# EAGLE design MBusUART-DIN (EAGLE 9.2.2)
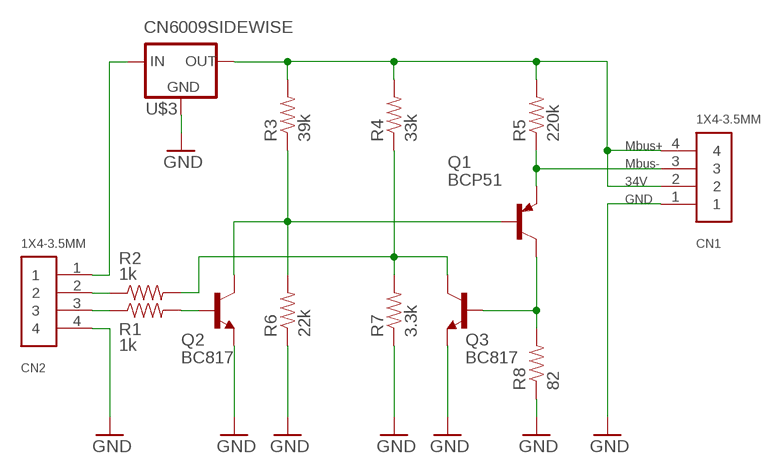
[diagram p0: schematic, sheet 1]

## Parts
CN1  1X4-3.5MM  [1X04-3.5MM]
CN2  1X4-3.5MM  [1X04-3.5MM]
Q1  BCP51  BCP51SOT223  [SOT223]
Q2  BC817  BC817-16SMD  [SOT23-BEC]
Q3  BC817  BC817-16SMD  [SOT23-BEC]
R1  1k  RESISTOR0805-RES  [0805]
R2  1k  RESISTOR0805-RES  [0805]
R3  39k  RESISTOR0805-RES  [0805]
R4  33k  RESISTOR0805-RES  [0805]
R5  220k  RESISTOR1206  [1206]
R6  22k  RESISTOR0805-RES  [0805]
R7  3.3k  RESISTOR0805-RES  [0805]
R8  82  RESISTOR1206  [1206]
U$3  CN6009SIDEWISE  [CN6009-SIDEWISE]

## Nets
34V: CN1.2 CN1.4 R3.2 R4.2 R5.2 U$3.P$4(OUT) U$3.P$41(OUT)
B: Q1.1(B) Q2.C R3.1 R6.2
GND: CN1.1 CN2.4 Q2.E Q3.E R6.1 R7.1 R8.1 U$3.P$1(GND) U$3.P$2(GND) U$3.P$11(GND) U$3.P$21(GND)
MBUS-: CN1.3 Q1.3(E) R5.1
N$1: Q3.C R2.2 R4.1 R7.2
N$2: CN2.1 U$3.P$3(IN) U$3.P$31(IN)
N$3: Q1.2(C) Q1.4(C) Q3.B R8.2
N$7: CN2.2 R2.1
N$8: CN2.3 R1.1
N$9: Q2.B R1.2

## Notes on the sheet
- Mbus+
- Mbus-

## Library data of the parts
CN1 CN2 = adafruit:1X4: 4-pin connector
Q1 = TaaraLabs:BCP51
Q2 Q3 = transistor-npn:BC817*: NPN Transistor
R1-R8 = SparkFun:RESISTOR: Resistor Basic schematic elements and footprints for 0603, 1206, and PTH resistors.
U$3 = TaaraLabs:CN6009

## Board
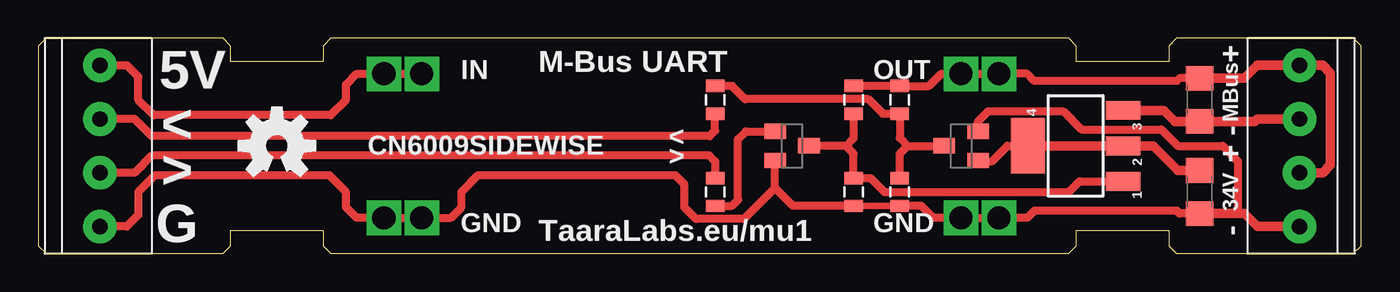
[diagram p1: board, top side]
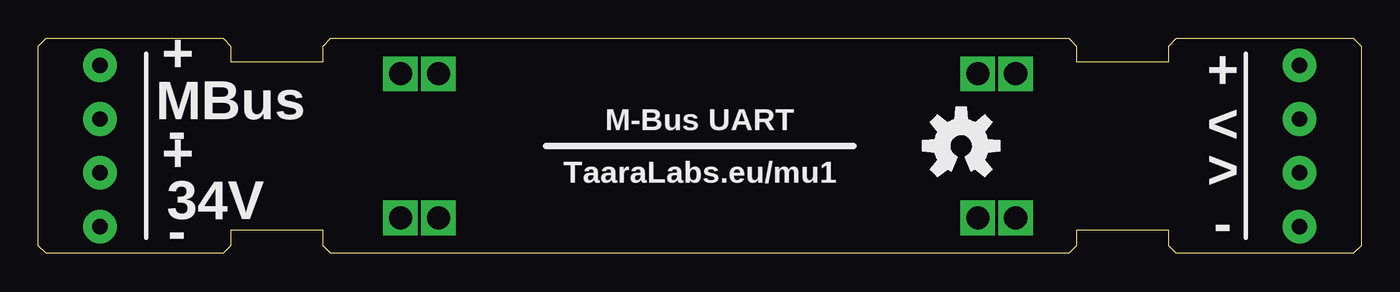
[diagram p2: board, bottom side, seen from below]

Size 86 x 14 mm. Coordinates in mm from the lower left corner, seen from the top.
Outline: 0,13.5 0,0.5 0.5,0 12,0 12.5,0.5 12.5,1.5 18.5,1.5 18.5,0.5 19,0 67,0 67.5,0.5 67.5,1.5 73.5,1.5 73.5,0.5 74,0 85.5,0 86,0.5 86,13.5 85.5,14 74,14 73.5,13.5 73.5,12.5 67.5,12.5 67.5,13.5 67,14 19,14 18.5,13.5 18.5,12.5 12.5,12.5 12.5,13.5 12,14 0.5,14 0,13.5
Copper layers (1*16): Top 0.035mm / dielectric 1.5mm / Bottom 0.035mm
Design rules "default": minimum track width 10mil, minimum drill 24mil, track to track 8mil, track to pad 8mil, pad to pad 8mil, via to via 8mil, smd to smd 8mil, copper to edge 40mil, drill to drill 8mil, minimum pad ring 10mil, minimum via ring 8mil, stop-mask expansion 4mil, vias tented up to drill 0mil, thermal gap 10mil

### Footprints (pad centres in the part's own frame; a part is rotated, then mirrored left to right if it is on the bottom)
1X04-3.5MM = drill 1 pad 2.184: 1 -5.25,0; 2 -1.75,0; 3 1.75,0; 4 5.25,0
SOT223 = smd 1.219 x 2.235: 1 -2.311,-3.099; 2 0,-3.099; 3 2.311,-3.099 | smd 3.6 x 2.2: 4 0,3.099
SOT23-BEC = smd 1 x 1.4: B -0.95,-1.1; C 0,1.1; E 0.95,-1.1
0805 = smd 0.8 x 1.2: 1 -0.9,0; 2 0.9,0
1206 = smd 1.6 x 1.8: 1 -1.4,0; 2 1.4,0
CN6009-SIDEWISE = drill 1.5 square: P$1 -20.04,-4.683; P$2 19.96,-4.683; P$3 -20.04,4.697; P$4 19.96,4.697; P$11 -17.575,-4.683; P$21 17.49,-4.683; P$31 -17.58,4.697; P$41 17.492,4.697

### Placement (x,y rotation side)
CN1  82,7 90 top
CN2  4,7 270 top
Q1  67.44,7 90 top
Q2  49,7 270 top
Q3  60,7 90 top
R1  44,4 270 top
R2  44,10 90 top
R3  53,10 90 top
R4  56,10 90 top
R5  75.5,10 90 top
R6  53,4 90 top
R7  56,4 90 top
R8  75.5,4 90 top
U$1  [OSHW-LOGO-M]  15.5,7 0 top
U$2  [OSHW-LOGO-M]  26,7 0 bottom
U$3  42.5,7 0 top

### Tracks (layer width: path | path; a pad name or v marks a point on that pad's centre or on a via)
34V
  Top 0.508: R3.2 R4.2 57.9,10.9 58.7,11.7 U$3.P$41 U$3.P$4 64.3,11.7 64.77,11.23 74.03,11.23 74.2,11.4 R5.2
  Top 0.61: CN1.2 83.5,5.25 84,5.75 84,11.75 83.5,12.25 CN1.4 79.25,12.25 78.4,11.4 R5.2
B
  Top 0.508: Q1.1 67.69,4.69 67,4 55,4 54.1,4.9 R6.2 53,6.5 52.5,7 | R3.1 53,7.5 52.5,7 | 52.5,7 Q2.C
GND
  Top 0.406: R7.1 R6.1
  Top 0.508: Q3.E 61.1,8.6 61.76,9.26 66.63,9.26 67.82,8.07 73.01,8.07 74.08,7 77,7 78,6 78,2.6 | R8.1 74.2,2.6 74.03,2.77 64.77,2.77 64.32,2.32 U$3.P$2 U$3.P$21 58.18,2.32 57.4,3.1 R7.1 | R6.1 49.06,3.1 47.9,4.26 | 47.9,4.26 Q2.E | 47.9,4.26 45.88,2.24 42.76,2.24 42,3 42,4.5 41.41,5.09 28.59,5.09 27.5,4 27.5,3 26.82,2.32 U$3.P$11 U$3.P$1 20.68,2.32 20,3 20,4 18.91,5.09 7.59,5.09 6.5,4 6.5,2.5 5.75,1.75 CN2.4
  Top 0.61: R8.1 78,2.6 78.4,2.6 79.25,1.75 CN1.1
MBUS-
  Top 0.61: CN1.3 79.25,8.75 79.1,8.6 R5.1 73.9,8.6 73.19,9.31 Q1.3
N$1
  Top 0.508: 56.5,7 56,7.5 R4.1 54.9,9.1 53.96,10.04 45.96,10.04 45.1,10.9 R2.2 | 56.5,7 Q3.C | R7.2 56,6.5 56.5,7
N$2
  Top 0.508: CN2.1 5.75,12.25 6.5,11.5 6.5,10 7.5,9 19,9 20,10 20,11 20.7,11.7 U$3.P$3 U$3.P$31
N$3
  Top 0.406: Q3.B 60.77,6.17
  Top 0.508: Q3.B 61.15,6 62,6 63,7 Q1.4
  Top 0.61: R8.2 74.1,5.4 72.5,7 Q1.2 Q1.4
N$7
  Top 0.508: R2.1 44,8 43.63,7.63 7.37,7.63 6.25,8.75 CN2.2
N$8
  Top 0.508: R1.1 44,6 43.63,6.37 7.37,6.37 6.25,5.25 CN2.3
N$9
  Top 0.508: R1.2 45.1,3.1 45.5,3.5 45.5,7.45 46,7.95 Q2.B

### Text on the board
tNames: + | 5V | M-Bus UART | MBus | < | < | - | > | > | + | 34V | G | TaaraLabs.eu/mu1 | -
bNames: + | + | MBus | < | M-Bus UART | - | > | TaaraLabs.eu/mu1 | + | 34V | - | -